# EAGLE design Mixer-Analog-OPA4134-Rev-K-multi (EAGLE 8.6.0)
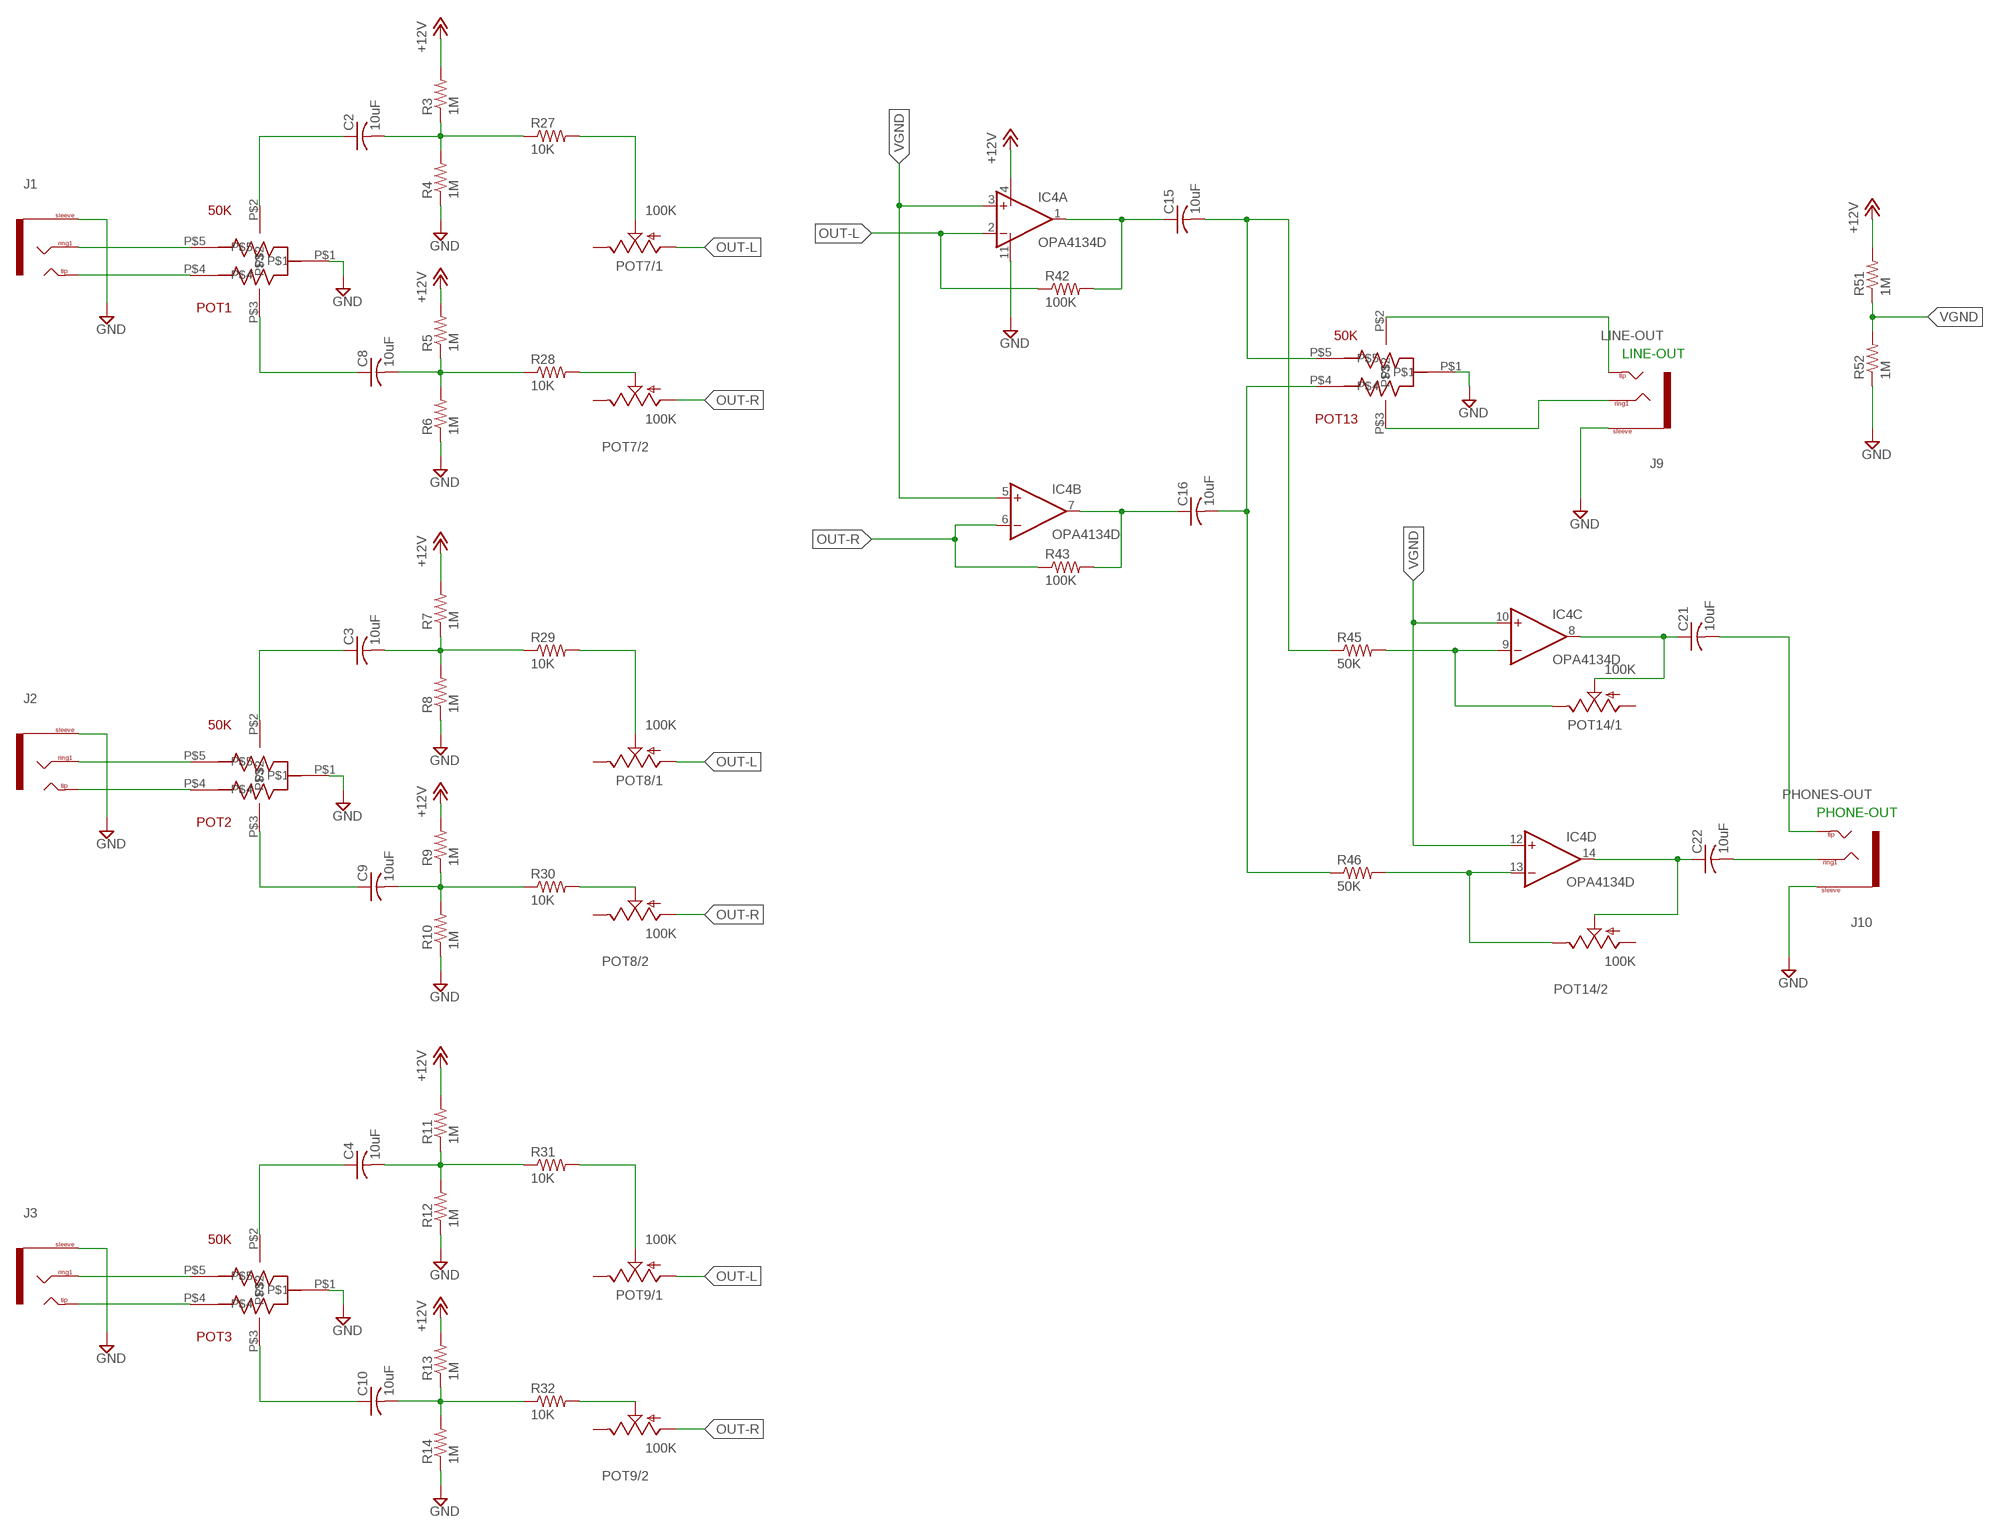
[diagram p0: schematic, sheet 1, part 1 of 2]
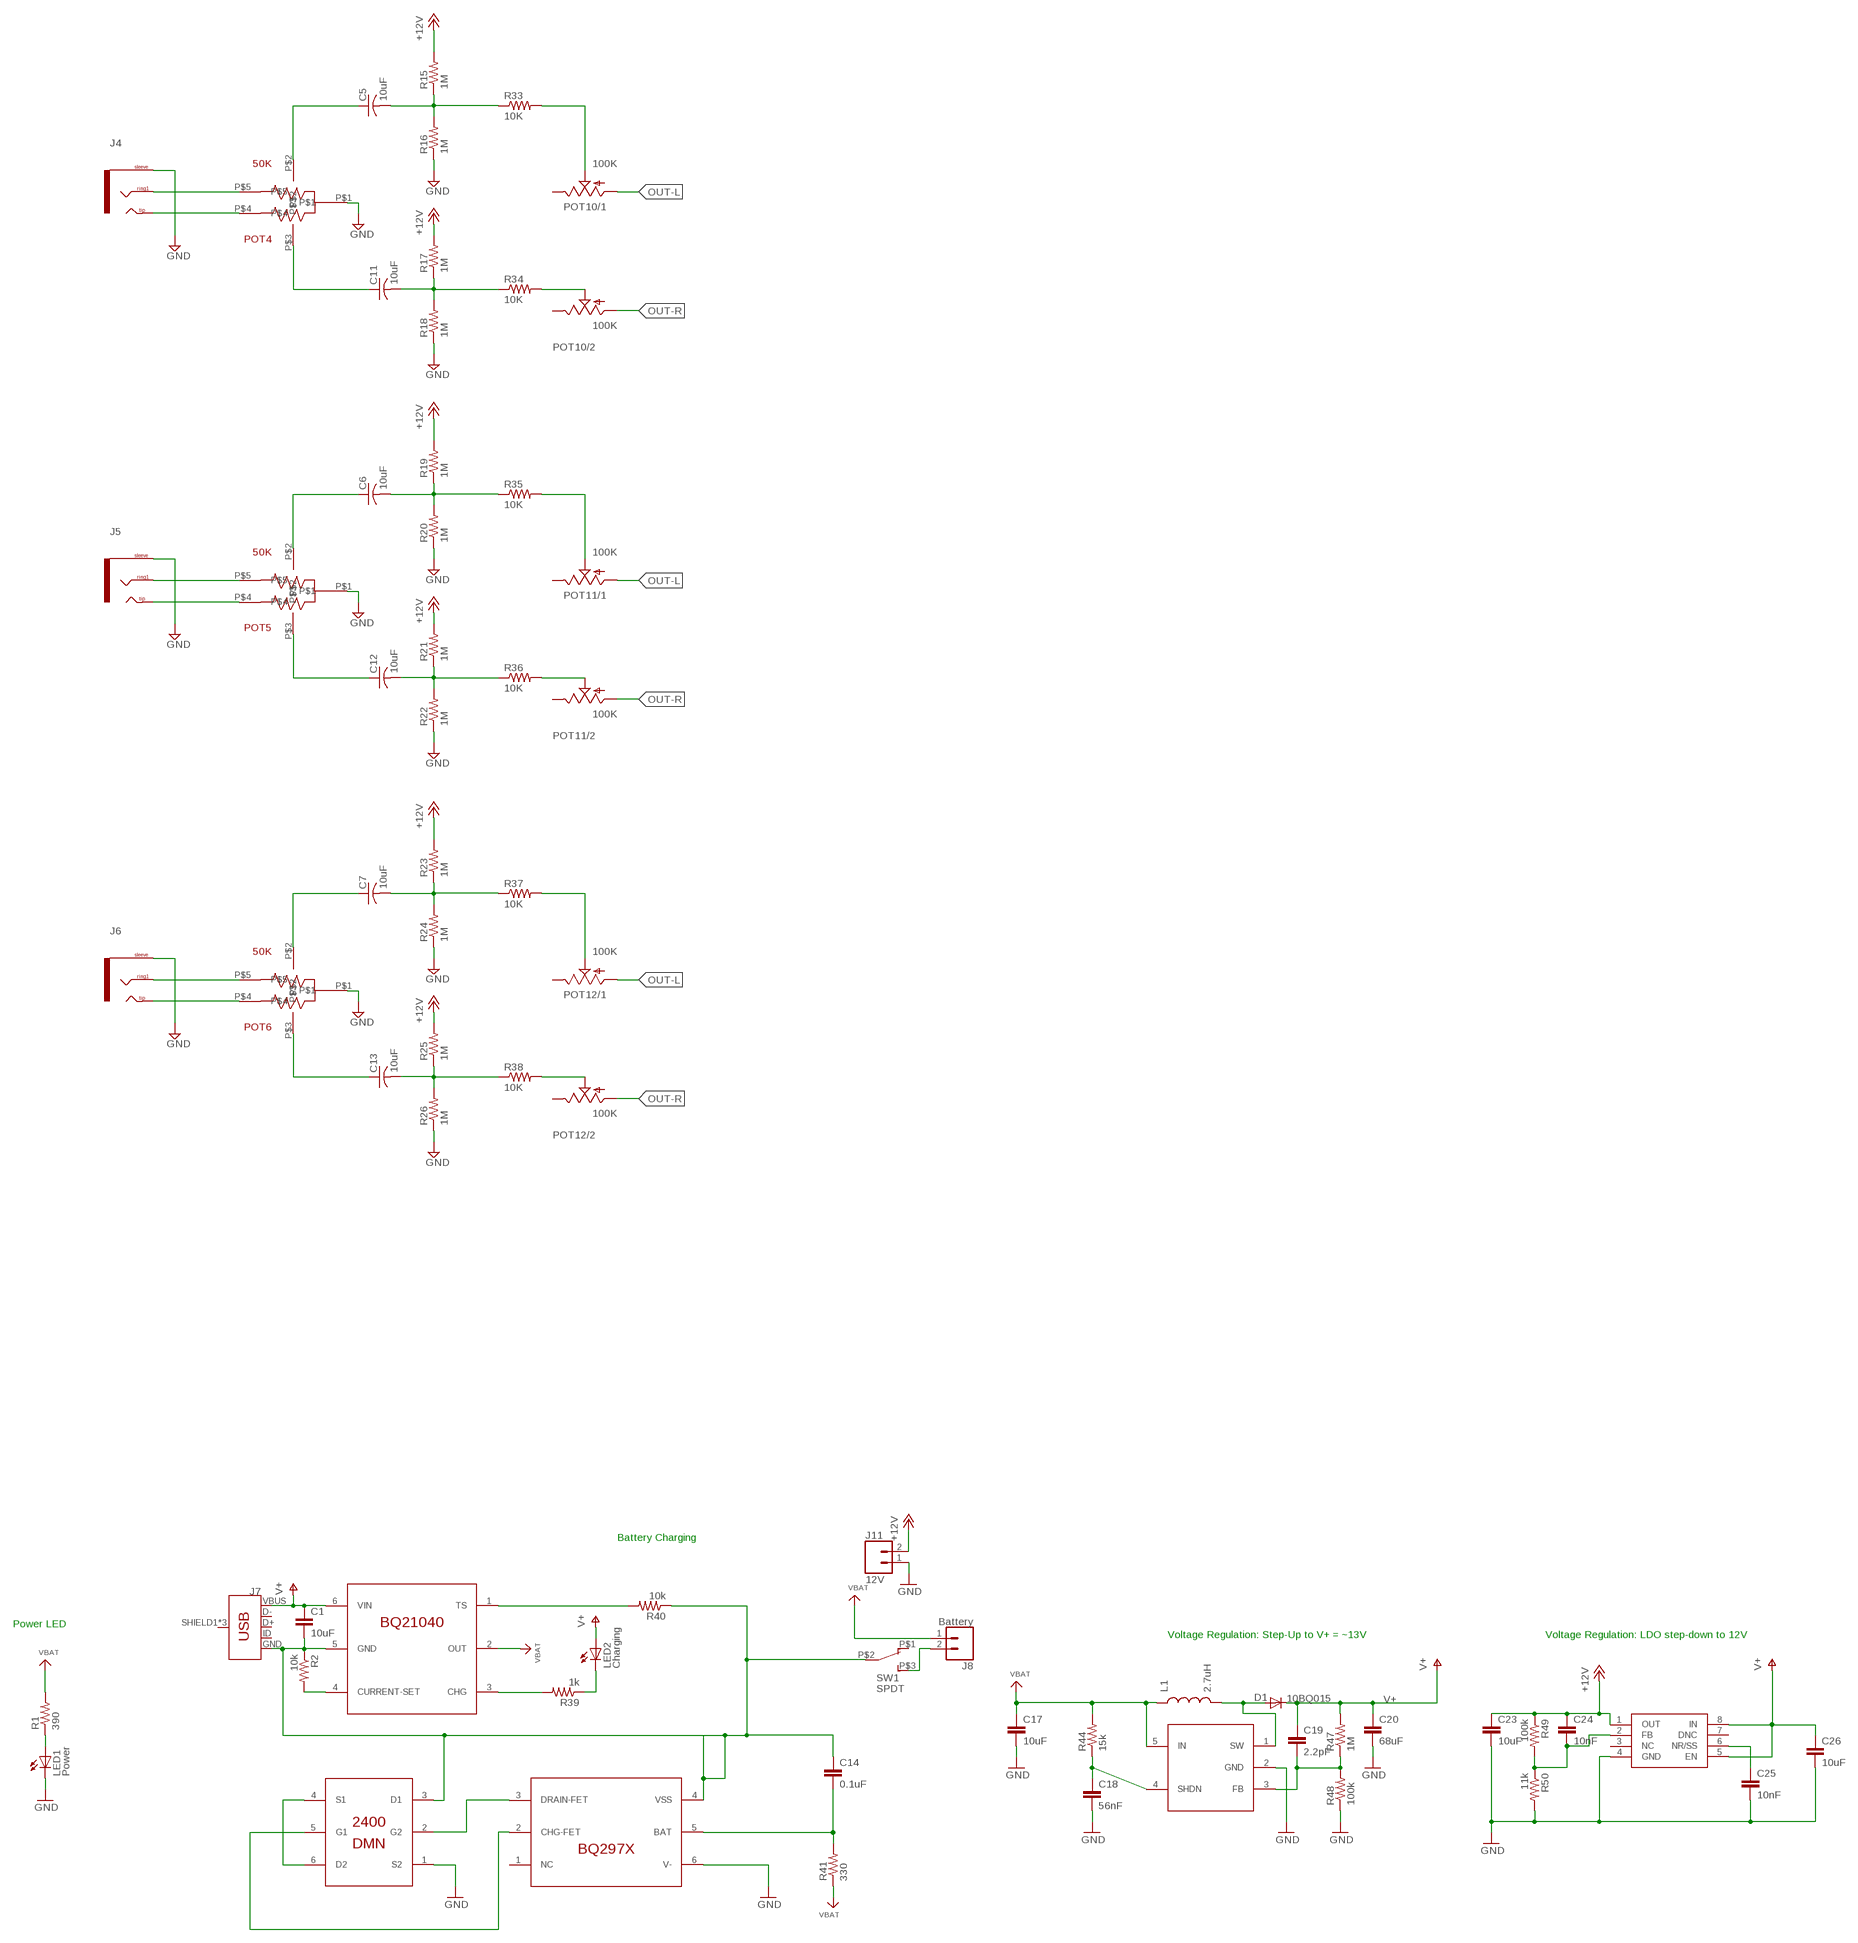
[diagram p1: schematic, sheet 1, part 2 of 2]

## Parts
C1  10uF  C-EUC0603  [C0603]
C2  10uF  C-USC0805K  [C0805K]
C3  10uF  C-USC0805K  [C0805K]
C4  10uF  C-USC0805K  [C0805K]
C5  10uF  C-USC0805K  [C0805K]
C6  10uF  C-USC0805K  [C0805K]
C7  10uF  C-USC0805K  [C0805K]
C8  10uF  C-USC0805K  [C0805K]
C9  10uF  C-USC0805K  [C0805K]
C10  10uF  C-USC0805K  [C0805K]
C11  10uF  C-USC0805K  [C0805K]
C12  10uF  C-USC0805K  [C0805K]
C13  10uF  C-USC0805K  [C0805K]
C14  0.1uF  C-EUC0603  [C0603]
C15  10uF  C-USC0805K  [C0805K]
C16  10uF  C-USC0805K  [C0805K]
C17  10uF  C-EUC0603  [C0603]
C18  56nF  C-EUC0603  [C0603]
C19  2.2pF  C-EUC0603  [C0603]
C20  68uF  C-EUC1206  [C1206]
C21  10uF  C-USC0805K  [C0805K]
C22  10uF  C-USC0805K  [C0805K]
C23  10uF  C-EUC0603  [C0603]
C24  10nF  C-EUC0603  [C0603]
C25  10nF  C-EUC0603  [C0603]
C26  10uF  C-EUC0603  [C0603]
D1  10BQ015  DIODESMA  [SMA-DIODE]
IC1  DMN2400  DUAL-NFET-DMN2400  [SOT-563]
IC2  BQ21040  BQ21040-LIPO-CHARGER  [SOT23-6]
IC3  BQ297X  BQ297X-BATTERY-MANAGER  [WSON-6]
IC4  OPA4134D  [SO14]
IC5  SC4503  [SOT23-5]
IC6  TPS7A49  [MSOP-8]
J1  TRS-1/8"-3.5MM  [TRS_SJ-3524-SMT]
J2  TRS-1/8"-3.5MM  [TRS_SJ-3524-SMT]
J3  TRS-1/8"-3.5MM  [TRS_SJ-3524-SMT]
J4  TRS-1/8"-3.5MM  [TRS_SJ-3524-SMT]
J5  TRS-1/8"-3.5MM  [TRS_SJ-3524-SMT]
J6  TRS-1/8"-3.5MM  [TRS_SJ-3524-SMT]
J7  USB_MICRO-BREDUCED_PASTE  [USB-B-MICRO-SMD_RED_PASTE]
J8  Battery  CONN_02LOCK  [1X02_LOCK]
J9  LINE-OUT  TRS-1/8"-3.5MM  [TRS_SJ-3524-SMT]
J10  PHONES-OUT  TRS-1/8"-3.5MM  [TRS_SJ-3524-SMT]
J11  12V  CONN_02LOCK  [1X02_LOCK]
L1  2.7uH  INDUCTORCR54-KIT  [CR54-KIT]
LED1  Power  LED3MM  [LED3MM]
LED2  Charging  LED3MM  [LED3MM]
POT1  50K  POT-DUAL-ALPS-RK10J12E0A0A  [POT-DUAL-ALPS-RK10J12E0A0A]
POT2  50K  POT-DUAL-ALPS-RK10J12E0A0A  [POT-DUAL-ALPS-RK10J12E0A0A]
POT3  50K  POT-DUAL-ALPS-RK10J12E0A0A  [POT-DUAL-ALPS-RK10J12E0A0A]
POT4  50K  POT-DUAL-ALPS-RK10J12E0A0A  [POT-DUAL-ALPS-RK10J12E0A0A]
POT5  50K  POT-DUAL-ALPS-RK10J12E0A0A  [POT-DUAL-ALPS-RK10J12E0A0A]
POT6  50K  POT-DUAL-ALPS-RK10J12E0A0A  [POT-DUAL-ALPS-RK10J12E0A0A]
POT7  100K  POT-DUAL-PTV112-4420  [PTV112]
POT8  100K  POT-DUAL-PTV112-4420  [PTV112]
POT9  100K  POT-DUAL-PTV112-4420  [PTV112]
POT10  100K  POT-DUAL-PTV112-4420  [PTV112]
POT11  100K  POT-DUAL-PTV112-4420  [PTV112]
POT12  100K  POT-DUAL-PTV112-4420  [PTV112]
POT13  50K  POT-DUAL-ALPS-RK10J12E0A0A  [POT-DUAL-ALPS-RK10J12E0A0A]
POT14  100K  POT-DUAL-PTV112-4420  [PTV112]
R1  390  R-US_R0603  [R0603]
R2  10k  R-US_R0603  [R0603]
R3  1M  RESISTOR0603-RES  [0603-RES]
R4  1M  RESISTOR0603-RES  [0603-RES]
R5  1M  RESISTOR0603-RES  [0603-RES]
R6  1M  RESISTOR0603-RES  [0603-RES]
R7  1M  RESISTOR0603-RES  [0603-RES]
R8  1M  RESISTOR0603-RES  [0603-RES]
R9  1M  RESISTOR0603-RES  [0603-RES]
R10  1M  RESISTOR0603-RES  [0603-RES]
R11  1M  RESISTOR0603-RES  [0603-RES]
R12  1M  RESISTOR0603-RES  [0603-RES]
R13  1M  RESISTOR0603-RES  [0603-RES]
R14  1M  RESISTOR0603-RES  [0603-RES]
R15  1M  RESISTOR0603-RES  [0603-RES]
R16  1M  RESISTOR0603-RES  [0603-RES]
R17  1M  RESISTOR0603-RES  [0603-RES]
R18  1M  RESISTOR0603-RES  [0603-RES]
R19  1M  RESISTOR0603-RES  [0603-RES]
R20  1M  RESISTOR0603-RES  [0603-RES]
R21  1M  RESISTOR0603-RES  [0603-RES]
R22  1M  RESISTOR0603-RES  [0603-RES]
R23  1M  RESISTOR0603-RES  [0603-RES]
R24  1M  RESISTOR0603-RES  [0603-RES]
R25  1M  RESISTOR0603-RES  [0603-RES]
R26  1M  RESISTOR0603-RES  [0603-RES]
R27  10K  RESISTOR0603-RES  [0603-RES]
R28  10K  RESISTOR0603-RES  [0603-RES]
R29  10K  RESISTOR0603-RES  [0603-RES]
R30  10K  RESISTOR0603-RES  [0603-RES]
R31  10K  RESISTOR0603-RES  [0603-RES]
R32  10K  RESISTOR0603-RES  [0603-RES]
R33  10K  RESISTOR0603-RES  [0603-RES]
R34  10K  RESISTOR0603-RES  [0603-RES]
R35  10K  RESISTOR0603-RES  [0603-RES]
R36  10K  RESISTOR0603-RES  [0603-RES]
R37  10K  RESISTOR0603-RES  [0603-RES]
R38  10K  RESISTOR0603-RES  [0603-RES]
R39  1k  R-US_R0603  [R0603]
R40  10k  R-US_R0603  [R0603]
R41  330  R-US_R0603  [R0603]
R42  100K  RESISTOR0603-RES  [0603-RES]
R43  100K  RESISTOR0603-RES  [0603-RES]
R44  15k  R-US_R0603  [R0603]
R45  50K  RESISTOR0603-RES  [0603-RES]
R46  50K  RESISTOR0603-RES  [0603-RES]
R47  1M  R-US_R0603  [R0603]
R48  100k  R-US_R0603  [R0603]
R49  100k  R-US_R0603  [R0603]
R50  11k  R-US_R0603  [R0603]
R51  1M  RESISTOR0603-RES  [0603-RES]
R52  1M  RESISTOR0603-RES  [0603-RES]
SW1  SPDT  SWITCH_SPDTCL-SB-12B  [SWITCH_SPDT_CL-SB-12B]

## Nets
+12V: C23.1 C24.1 IC4.4(P:V+) IC6.1(OUT) J11.2 R3.2 R5.2 R7.2 R9.2 R11.2 R13.2 R15.2 R17.2 R19.2 R21.2 R23.2 R25.2 R49.1 R51.2
GND: C17.2 C18.2 C20.2 C23.2 C25.2 C26.2 IC1.1(S2) IC3.6(V-) IC4.11(P:V-) IC6.4(GND) J1.1(SLEEVE) J2.1(SLEEVE) J3.1(SLEEVE) J4.1(SLEEVE) J5.1(SLEEVE) J6.1(SLEEVE) J9.1(SLEEVE) J10.1(SLEEVE) J11.1 LED1.K(C) POT1.P$1 POT2.P$1 POT3.P$1 POT4.P$1 POT5.P$1 POT6.P$1 POT13.P$1 R4.1 R6.1 R8.1 R10.1 R12.1 R14.1 R16.1 R18.1 R20.1 R22.1 R24.1 R26.1 R48.1 R50.2 R52.1
GND1: C1.2 C14.1 IC1.3(D1) IC2.5(GND) IC3.4(VSS) J7.GND R2.1 R40.1 SW1.P$2
N$1: C8.1 POT1.P$3
N$2: J8.2 SW1.P$3
N$3: C8.2 R5.1 R6.2 R28.1
N$5: J1.3(RING1) POT1.P$5
N$7: C15.1 IC4.1(A:OUT) R42.2
N$8: C2.1 POT1.P$2
N$9: J1.2(TIP) J1.4(TIP) POT1.P$4
N$13: C2.2 R3.1 R4.2 R27.1
N$15: IC4.13(D:-IN) POT14.2.3(/2:E) R46.2
N$16: J9.2(TIP) J9.4(TIP) POT13.P$2
N$17: C16.1 IC4.7(B:OUT) R43.2
N$18: J9.3(RING1) POT13.P$3
N$19: POT7.2.2(/2:S) R28.2
N$21: C22.2 J10.3(RING1)
N$22: C9.2 R9.1 R10.2 R30.1
N$23: C21.2 J10.2(TIP) J10.4(TIP)
N$24: C21.1 IC4.8(C:OUT) POT14.1.2(/1:S)
N$25: C22.1 IC4.14(D:OUT) POT14.2.2(/2:S)
N$26: J2.3(RING1) POT2.P$5
N$27: POT8.1.2(/1:S) R29.2
N$28: C9.1 POT2.P$3
N$29: C3.1 POT2.P$2
N$30: J2.2(TIP) J2.4(TIP) POT2.P$4
N$31: C3.2 R7.1 R8.2 R29.1
N$32: POT8.2.2(/2:S) R30.2
N$41: C10.2 R13.1 R14.2 R32.1
N$42: J3.3(RING1) POT3.P$5
N$43: POT9.1.2(/1:S) R31.2
N$44: C10.1 POT3.P$3
N$45: C4.1 POT3.P$2
N$46: J3.2(TIP) J3.4(TIP) POT3.P$4
N$47: C4.2 R11.1 R12.2 R31.1
N$48: POT9.2.2(/2:S) R32.2
N$55: POT7.1.2(/1:S) R27.2
N$58: C11.2 R17.1 R18.2 R34.1
N$59: J4.3(RING1) POT4.P$5
N$60: POT10.1.2(/1:S) R33.2
N$61: C15.2 POT13.P$5 R45.1
N$62: C11.1 POT4.P$3
N$63: C5.1 POT4.P$2
N$64: J4.2(TIP) J4.4(TIP) POT4.P$4
N$65: C5.2 R15.1 R16.2 R33.1
N$66: POT10.2.2(/2:S) R34.2
N$75: C12.2 R21.1 R22.2 R36.1
N$76: J5.3(RING1) POT5.P$5
N$77: POT11.1.2(/1:S) R35.2
N$78: C12.1 POT5.P$3
N$79: C6.1 POT5.P$2
N$80: J5.2(TIP) J5.4(TIP) POT5.P$4
N$81: C6.2 R19.1 R20.2 R35.1
N$82: POT11.2.2(/2:S) R36.2
N$91: C13.2 R25.1 R26.2 R38.1
N$92: J6.3(RING1) POT6.P$5
N$93: POT12.1.2(/1:S) R37.2
N$94: C13.1 POT6.P$3
N$95: C7.1 POT6.P$2
N$96: J6.2(TIP) J6.4(TIP) POT6.P$4
N$97: C7.2 R23.1 R24.2 R37.1
N$98: POT12.2.2(/2:S) R38.2
N$114: LED1.A R1.1
N$115: D1.A IC5.1(SW) L1.P$2
N$116: C18.1 IC5.4(SHDN) R44.1
N$117: C19.2 IC5.3(FB) R47.1 R48.2
N$118: C24.2 IC6.2(FB) R49.2 R50.1
N$119: C25.1 IC6.6(NR/SS)
N$121: LED2.K(C) R39.1
N$122: IC2.3(CHG) R39.2
N$123: IC2.1(TS) R40.2
N$124: IC2.4(CURRENT-SET) R2.2
N$125: C14.2 IC3.5(BAT) R41.2
N$126: IC1.4(S1) IC1.6(D2)
N$127: IC1.5(G1) IC3.2(CHG-FET)
N$128: IC1.2(G2) IC3.3(DRAIN-FET)
OUT-L: IC4.2(A:-IN) POT7.1.1(/1:A) POT8.1.1(/1:A) POT9.1.1(/1:A) POT10.1.1(/1:A) POT11.1.1(/1:A) POT12.1.1(/1:A) R42.1
OUT-L1: IC4.9(C:-IN) POT14.1.3(/1:E) R45.2
OUT-R: IC4.6(B:-IN) POT7.2.1(/2:A) POT8.2.1(/2:A) POT9.2.1(/2:A) POT10.2.1(/2:A) POT11.2.1(/2:A) POT12.2.1(/2:A) R43.1
OUT-R1: C16.2 POT13.P$4 R46.1
V+: C1.1 C19.1 C20.1 C26.1 D1.C IC2.6(VIN) IC6.5(EN) IC6.8(IN) J7.VBUS LED2.A R47.2
VBAT: C17.1 IC2.2(OUT) IC5.5(IN) J8.1 L1.P$1 R1.2 R41.1 R44.2
VGND: IC4.3(A:+IN) IC4.5(B:+IN) IC4.10(C:+IN) IC4.12(D:+IN) R51.1 R52.2
Unconnected: IC3.1(NC) IC5.2(GND) IC6.3(NC) IC6.7(DNC) J7.D+ J7.D- J7.ID J7.SHIELD1(SHIELD) J7.SHIELD2(SHIELD) J7.SHIELD3(SHIELD) POT7.1.3(/1:E) POT7.2.3(/2:E) POT8.1.3(/1:E) POT8.2.3(/2:E) POT9.1.3(/1:E) POT9.2.3(/2:E) POT10.1.3(/1:E) POT10.2.3(/2:E) POT11.1.3(/1:E) POT11.2.3(/2:E) POT12.1.3(/1:E) POT12.2.3(/2:E) POT14.1.1(/1:A) POT14.2.1(/2:A) SW1.P$1

## Notes on the sheet
- LINE-OUT
- PHONE-OUT
- Battery Charging
- Power LED
- Voltage Regulation: Step-Up to V+ = ~13V | Voltage Regulation: LDO step-down to 12V

## Library data of the parts
C1 C14 C17-C20 C23-C26 = rcl:C-EU: CAPACITOR, European symbol; SPICEPREFIX: C
C2-C13 C15 C16 C21 C22 = adafruit:C-US: CAPACITOR, American symbol
D1 = SparkFun:DIODE: Diode These are standard reverse protection diodes and small signal diodes. SMA package can handle up to about 1A. SOD-323 can handle about 200mA. What the SOD-323 package when ordering, there are some mfgs out there that are 5-pin packages.
IC1 = CMU-ArtFab:DUAL-NFET-DMN2400
IC2 = CMU-ArtFab:BQ21040-LIPO-CHARGER
IC3 = CMU-ArtFab:BQ297X-BATTERY-MANAGER
IC4 = linear:OPA4134: SoundPLUS (TM) High Performance AUDIO OPERATIONAL AMPLIFIERS Source: http://focus.ti.com/lit/ds/sbos058/sbos058.pdf
IC5 = CMU-ArtFab:SC4503
IC6 = CMU-ArtFab:TPS7A49
J1-J6 J9 J10 = CMU-ArtFab:TRS-1/8"-3.5MM
J7 = SparkFun-Connectors:USB_MICRO-B: USB Type Micro-B Connector Male/female and PTH/SMT variants SparkFun Products: SparkFun microB USB Breakout <https://www.sparkfun.com/products/12035> SparkFun USB microB Plug Breakout <https://www.sparkfun.com/products/10031> SparkFun ESP8266 Thing <https://www.sparkfun.com/products/13231>; PROD_ID: CONN-11752
J8 J11 = SparkFun-Connectors:CONN_02: Multi connection point. Often used as Generic Header-pin footprint for 0.1 inch spaced/style header connections On any of the 0.1 inch spaced packages, you can populate with these: Break Away Headers - Straight <https://www.sparkfun.com/products/116> (PRT-00116) Break Away Male Headers - Right Angle <https://www.sparkfun.com/products/553> (PRT-00553) Female Headers <https://www.sparkfun.com/products/115> (PRT-00115) Break Away Headers - Machine Pin <https://www.sparkfun.com/products/117> (PRT-00117) Break Away Female Headers - Swiss Machine Pin <https://www.sparkfun.com/products/743> (PRT-00743) For SCREWTERMINALS and SPRING TERMINALS visit here: Screw Terimnals on SparkFun.com <https://www.sparkfun.com/search/results?term=Screw+Terminals> (5mm/3.5mm/2.54mm spacing) This device is also useful as a general connection point to wire up your design to another part of your project. Our various solder wires solder well into these plated through hole pads. Hook-Up Wire - Assortment (Stranded, 22 AWG) <https://www.sparkfun.com/products/11375> (PRT-11375) Hook-Up Wire - Assortment (Solid Core, 22 AWG) <https://www.sparkfun.com/products/11367> (PRT-11367) View the entire wire category on our website here <https://www.sparkfun.com/categories/141> Special notes: Molex polarized connector foot print use with: PRT-08233 with associated crimp pins and housings. 2.54_SCREWTERM for use with PRT-10571. 3.5mm Screw Terminal footprints for PRT-08084 5mm Screw Terminal footprints for use with PRT-08432
L1 = SparkFun-Passives:INDUCTOR: Inductors Basic Inductor/Choke - 0603 and 1206. Footprints are not proven and vary greatly between part numbers. SRN6045- 33uH, 20% 1.4A SDR0403-560KL - 56uH, 10%, 500mA RMS/740mA peak
LED1 LED2 = led:LED: LED OSRAM: - CHIPLED LG R971, LG N971, LY N971, LG Q971, LY Q971, LO R971, LY R971 LH N974, LH R974 LS Q976, LO Q976, LY Q976 LO Q996 - Hyper CHIPLED LW Q18S LB Q993, LB Q99A, LB R99A - SideLED LS A670, LO A670, LY A670, LG A670, LP A670 LB A673, LV A673, LT A673, LW A673 LH A674 LY A675 LS A676, LA A676, LO A676, LY A676, LW A676 LS A679, LY A679, LG A679 - Hyper Micro SIDELED® LS Y876, LA Y876, LO Y876, LY Y876 LT Y87S - SmartLED LW L88C, LW L88S LB L89C, LB L89S, LG L890 LS L89K, LO L89K, LY L89K LS L896, LA L896, LO L896, LY L896 - TOPLED LS T670, LO T670, LY T670, LG T670, LP T670 LSG T670, LSP T670, LSY T670, LOP T670, LYG T670 LG T671, LOG T671, LSG T671 LB T673, LV T673, LT T673, LW T673 LH T674 LS T676, LA T676, LO T676, LY T676, LB T676, LH T676, LSB T676, LW T676 LB T67C, LV T67C, LT T67C, LS T67K, LO T67K, LY T67K, LW E67C LS E67B, LA E67B, LO E67B, LY E67B, LB E67C, LV E67C, LT E67C LW T67C LS T679, LY T679, LG T679 LS T770, LO T770, LY T770, LG T770, LP T770 LB T773, LV T773, LT T773, LW T773 LH T774 LS E675, LA E675, LY E675, LS T675 LS T776, LA T776, LO T776, LY T776, LB T776 LHGB T686 LT T68C, LB T68C - Hyper Mini TOPLED® LB M676 - Mini TOPLED Santana® LG M470 LS M47K, LO M47K, LY M47K Source: http://www.osram.convergy.de LUXEON: - LUMILED® LXK2-PW12-R00, LXK2-PW12-S00, LXK2-PW14-U00, LXK2-PW14-V00 LXK2-PM12-R00, LXK2-PM12-S00, LXK2-PM14-U00 LXK2-PE12-Q00, LXK2-PE12-R00, LXK2-PE12-S00, LXK2-PE14-T00, LXK2-PE14-U00 LXK2-PB12-K00, LXK2-PB12-L00, LXK2-PB12-M00, LXK2-PB14-N00, LXK2-PB14-P00, LXK2-PB14-Q00 LXK2-PR12-L00, LXK2-PR12-M00, LXK2-PR14-Q00, LXK2-PR14-R00 LXK2-PD12-Q00, LXK2-PD12-R00, LXK2-PD12-S00 LXK2-PH12-R00, LXK2-PH12-S00 LXK2-PL12-P00, LXK2-PL12-Q00, LXK2-PL12-R00 Source: www.luxeon.com KINGBRIGHT: KA-3528ASYC Source: www.kingbright.com
POT1-POT6 POT13 = CMU-ArtFab:POT-DUAL-ALPS-RK10J12E0A0A
POT7-POT12 POT14 = CMU-ArtFab:POT-DUAL-PTV112: Bourns 11mm dual potentiometer; AVAILABILITY: Unavailable; DESCRIPTION: Alt# Tce-10111410; MF: STMicroelectronics; MP: PTV112; PACKAGE: None; PRICE: None; SPICEPREFIX: J
R1 R2 R39-R41 R44 R47-R50 = CMU-ArtFab:R-US_: RESISTOR, American symbol
R3-R38 R42 R43 R45 R46 = SparkFun-Passives:RESISTOR: Resistor Basic schematic elements and footprints for 0603, 1206, and PTH resistors.; SPICEPREFIX: R
R51 R52 = SparkFun-Passives:RESISTOR: Resistor Basic schematic elements and footprints for 0603, 1206, and PTH resistors.
SW1 = CMU-ArtFab:SWITCH_SPDT

## Board
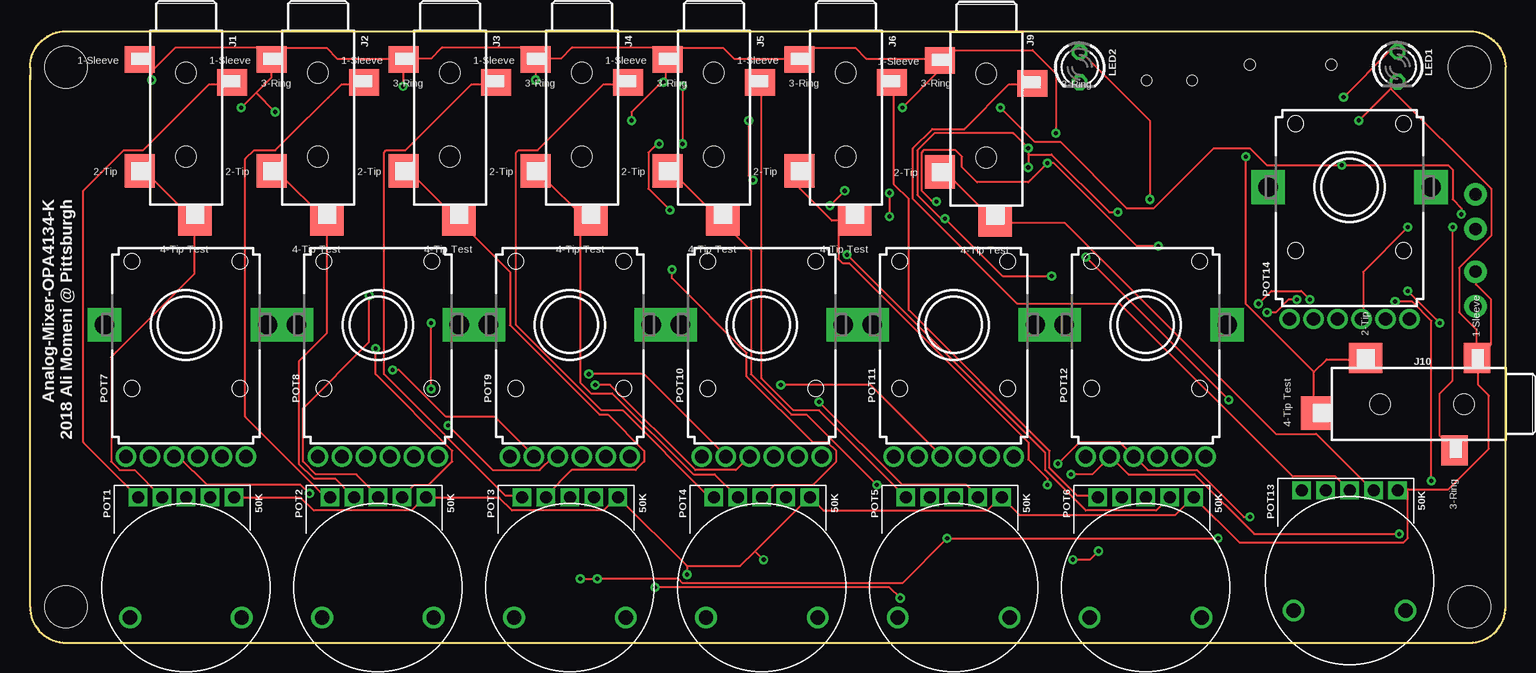
[diagram p2: board, top side]
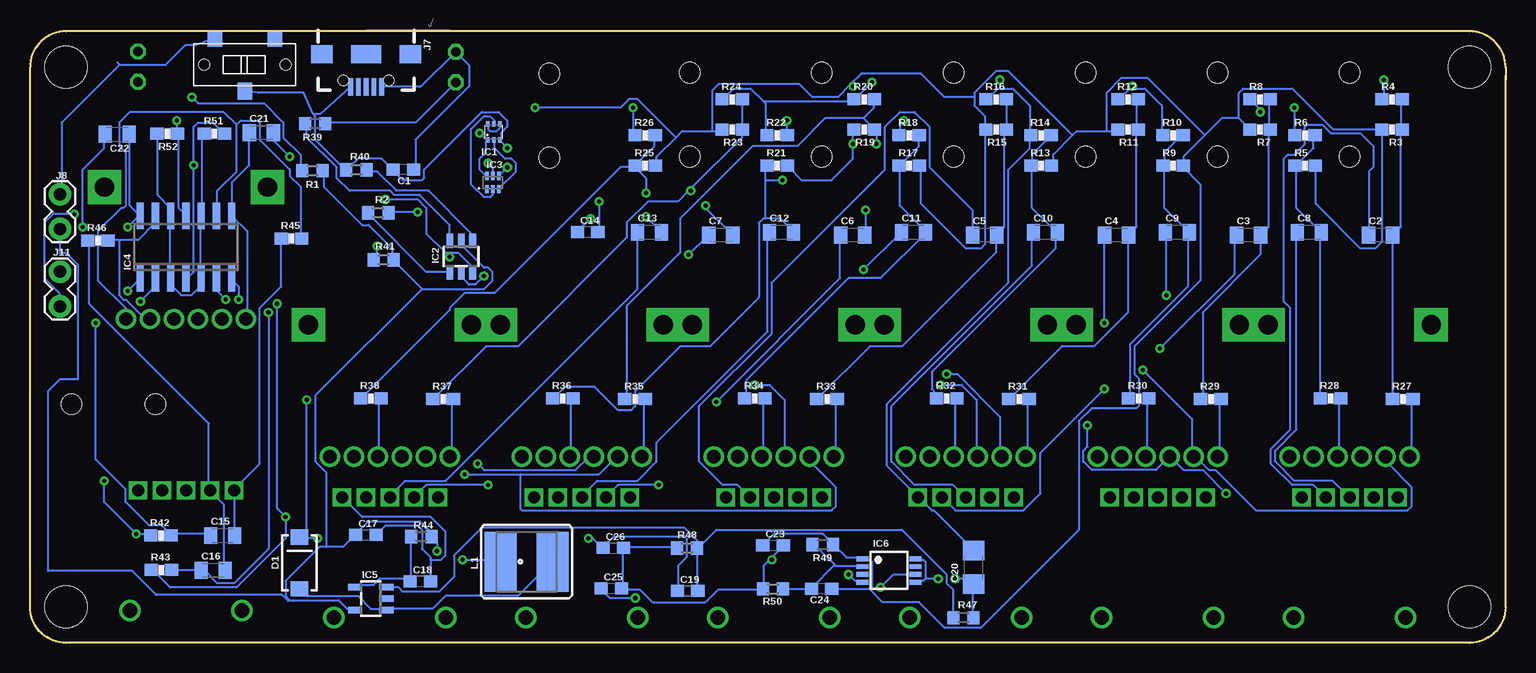
[diagram p3: board, bottom side, seen from below]

Size 123 x 51 mm. Coordinates in mm from the lower left corner, seen from the top.
Outline: 0,47 0,47.3
Outline: 0,47 0,48 arc-90 3,51 120,51 arc-90 123,48 123,3 arc-90 120,0 3,0 arc-90 0,3 0,47
Copper layers (1*16): Top 0.035mm / dielectric 1.5mm / Bottom 0.035mm
Design rules "default *": minimum track width 6mil, minimum drill 0.35mm, track to track 8mil, track to pad 8mil, pad to pad 8mil, via to via 8mil, smd to smd 8mil, copper to edge 40mil, drill to drill 6mil, minimum pad ring 10mil, minimum via ring 8mil, stop-mask expansion 4mil, vias tented up to drill 0mil, thermal gap 10mil
Holes 3.5 mm at 3,48 3,3 120,3 120,48

### Footprints (pad centres in the part's own frame; a part is rotated, then mirrored left to right if it is on the bottom)
C0603 = smd 1.1 x 1: 1 -0.85,0; 2 0.85,0
C0805K = smd 1.1 x 1.4: 1 -1,0; 2 1,0
C1206 = smd 1.6 x 1.8: 1 -1.4,0; 2 1.4,0
SMA-DIODE = smd 1.27 x 1.47: A -2.15,0; C 2.15,0
SOT-563 = smd 0.3 x 0.45: 1 -0.5,-0.675; 2 0,-0.675; 3 0.5,-0.675; 4 0.5,0.675; 5 0,0.675; 6 -0.5,0.675
SOT23-6 = smd 0.55 x 1.2: 1 -0.95,-1.3; 2 0,-1.3; 3 0.95,-1.3; 4 0.95,1.3; 5 0,1.3; 6 -0.95,1.3
WSON-6 = smd 0.3 x 0.7: 1 -0.5,-0.55; 2 0,-0.55; 3 0.5,-0.55; 4 0.5,0.55; 5 0,0.55; 6 -0.5,0.55
SO14 = smd 0.6 x 2.2: 1 -3.81,-2.6; 2 -2.54,-2.6; 3 -1.27,-2.6; 4 0,-2.6; 5 1.27,-2.6; 6 2.54,-2.6; 7 3.81,-2.6; 8 3.81,2.6; 9 2.54,2.6; 10 1.27,2.6; 11 0,2.6; 12 -1.27,2.6; 13 -2.54,2.6; 14 -3.81,2.6
SOT23-5 = smd 0.55 x 1.2: 1 -0.95,-1.3; 2 0,-1.3; 3 0.95,-1.3; 4 0.95,1.3; 5 -0.95,1.3
MSOP-8 = smd 0.4 x 1: 1 -0.975,-2.2; 2 -0.325,-2.2; 3 0.325,-2.2; 4 0.975,-2.2; 5 0.975,2.2; 6 0.325,2.2; 7 -0.325,2.2; 8 -0.975,2.2
TRS_SJ-3524-SMT = smd 2.5 x 2.2: 1 3.85,-4.6; 3 -3.85,-2.7 | smd 2.5 x 2.8: 2 3.85,4.7 | smd 2.8 x 2.5: 4 -0.75,8.85 | hole 1.7: 0,-3.5; 0,3.5
USB-B-MICRO-SMD_RED_PASTE = smd 1.45 x 0.4: D+ 2.725,0; D- 2.725,0.65; GND 2.725,-1.3; ID 2.725,-0.65; VBUS 2.725,1.3 | smd 1.5 x 1.8: SHIELD1 0,3.685; SHIELD2 0,-3.685 | smd 1.5 x 2.5: SHIELD3 0,0 | hole 0.85: 2.2,1.9; 2.2,-1.9
1X02_LOCK = drill 1.016 pad 1.88: 1 -0.178,0; 2 2.718,0
CR54-KIT = smd 5 x 2.65: P$1 0,2.17; P$2 0,-2.17
LED3MM = drill 0.813 octagon: A -1.27,0; K 1.27,0
POT-DUAL-ALPS-RK10J12E0A0A = drill 1 pad 1.321 square: P$1 -4,0; P$2 -2,0; P$3 0,0; P$4 2,0; P$5 4,0 | drill 1.2: P$6 4.65,10; P$7 -4.65,10
PTV112 = drill 1.1 pad 1.676: 1.1 -3,-11; 1.2 -5,-11; 1.3 5,-11; 2.1 -1,-11; 2.2 1,-11; 2.3 3,-11 | drill 1.6 pad 2.8 square: M1 -6.8,0; M2 6.8,0
R0603 = smd 1 x 1.1: 1 -0.85,0; 2 0.85,0
0603-RES = smd 1.1 x 1: 1 -0.85,0; 2 0.85,0
SWITCH_SPDT_CL-SB-12B = smd 1.2 x 1.4: P$1 -2.5,-2.2; P$2 0,2.2; P$3 2.5,-2.2 | hole 0.9: -3.4,0; 3.4,0

### Placement (x,y rotation side)
C1  91.88,39.46 180 bottom
C2  10.42,34 0 bottom
C3  21.42,34 0 bottom
C4  32.42,34 0 bottom
C5  43.42,34 0 bottom
C6  54.42,34 0 bottom
C7  65.42,34 0 bottom
C8  16.35,34.23 0 bottom
C9  27.35,34.23 0 bottom
C10  38.35,34.23 0 bottom
C11  49.35,34.23 0 bottom
C12  60.35,34.23 0 bottom
C13  71.35,34.23 0 bottom
C14  76.51,34.27 0 bottom
C15  106.94,8.94 0 bottom
C16  107.73,6.04 0 bottom
C17  95,9 0 bottom
C18  90.46,5.14 0 bottom
C19  68.18,4.33 0 bottom
C20  44.33,6.29 90 bottom
C21  103.71,42.54 0 bottom
C22  115.73,42.41 180 bottom
C23  61.06,8.13 0 bottom
C24  57.01,4.52 180 bottom
C25  74.55,4.54 0 bottom
C26  74.38,7.9 0 bottom
D1  100.53,6.66 90 bottom
IC1  84.34,42.61 0 bottom
IC2  87.06,32.21 180 bottom
IC3  84.43,38.39 0 bottom
IC4  110,33 0 bottom
IC5  94.59,3.69 90 bottom
IC6  51.39,6.03 270 bottom
J1  13,44.04 180 top
J2  24,44.04 180 top
J3  35,44.04 180 top
J4  46,44.04 180 top
J5  57,44.04 180 top
J6  68,44.04 180 top
J7  94.98,49.09 270 bottom
J8  120.5,34.68 90 bottom
J9  79.72,43.96 180 top
J10  116.04,19.9 90 top
J11  120.5,30.77 270 bottom
L1  81.6,6.77 90 bottom
LED1  114,48.05 270 top
LED2  87.5,48.01 270 top
POT1  13,12.12 180 top
POT2  29,12.12 180 top
POT3  45,12.12 180 top
POT4  61,12.12 180 top
POT5  77,12.12 180 top
POT6  93,12.12 180 top
POT7  13,26.52 0 top
POT8  29,26.52 0 top
POT9  45,26.52 0 top
POT10  61,26.52 0 top
POT11  77,26.52 0 top
POT12  93,26.52 0 top
POT13  110,12.7 180 top
POT14  110,38 0 top
R1  99.46,39.37 0 bottom
R2  93.97,35.85 180 bottom
R3  9.46,42.8 180 bottom
R4  9.46,45.32 0 bottom
R5  16.7,39.79 0 bottom
R6  16.72,42.32 0 bottom
R7  20.46,42.8 180 bottom
R8  20.46,45.32 0 bottom
R9  27.7,39.79 0 bottom
R10  27.72,42.32 0 bottom
R11  31.46,42.8 180 bottom
R12  31.46,45.32 0 bottom
R13  38.7,39.79 0 bottom
R14  38.72,42.32 0 bottom
R15  42.46,42.8 180 bottom
R16  42.46,45.32 0 bottom
R17  49.7,39.79 0 bottom
R18  49.72,42.32 0 bottom
R19  53.46,42.8 180 bottom
R20  53.46,45.32 0 bottom
R21  60.7,39.79 0 bottom
R22  60.72,42.32 0 bottom
R23  64.46,42.8 180 bottom
R24  64.46,45.32 0 bottom
R25  71.7,39.79 0 bottom
R26  71.72,42.32 0 bottom
R27  8.56,20.33 0 bottom
R28  14.59,20.38 0 bottom
R29  24.56,20.33 0 bottom
R30  30.59,20.38 0 bottom
R31  40.56,20.33 0 bottom
R32  46.59,20.38 0 bottom
R33  56.56,20.33 0 bottom
R34  62.59,20.38 0 bottom
R35  72.56,20.33 0 bottom
R36  78.59,20.38 0 bottom
R37  88.56,20.33 0 bottom
R38  94.59,20.38 0 bottom
R39  99.23,43.3 180 bottom
R40  95.78,39.44 0 bottom
R41  93.52,31.93 180 bottom
R42  112.1,8.94 0 bottom
R43  112.04,6.07 0 bottom
R44  90.38,8.86 0 bottom
R45  101.2,33.72 0 bottom
R46  117.35,33.55 0 bottom
R47  45.19,2.1 0 bottom
R48  68.23,7.9 0 bottom
R49  56.91,8.18 180 bottom
R50  61.06,4.5 180 bottom
R51  107.61,42.46 0 bottom
R52  111.56,42.44 180 bottom
SW1  105.09,48.21 180 bottom

### Tracks (layer width: path | path; a pad name or v marks a point on that pad's centre or on a via)
+12V  (via drill 0.35)
  Top 0.152: v54.41,46.41 v54.41,41.6 | v80.9,44.63 83.74,41.78 85.88,41.78 91.39,36.27 93.7,36.27 98.68,41.25 101.7,41.25 103.12,39.83 v109.35,39.83 118.24,39.83 118.59,39.47 118.59,36.98 119.3,36.27 v119.3,35.74
  Bottom 0.152: 52.98,4.45 56.01,4.45 C24.1 | 52.98,4.45 52.81,4.62 52.81,6.76 52.98,6.93 53.52,6.93 IC6.1 53.7,7.11 54.94,7.11 56.01,8.18 R49.1 56.19,8.36 56.9,9.07 60.98,9.07 61.87,8.18 C23.1 | 22.23,43.74 22.23,45.87 21.87,46.23 17.78,46.23 14.4,42.85 10.31,42.85 R3.2 10.31,42.67 10.31,33.43 10.85,32.89 12.09,32.89 15.82,36.63 15.82,39.65 R5.2 | 22.23,43.74 21.34,42.85 R7.2 | 25.07,42.32 23.65,43.74 22.23,43.74 | 25.07,42.32 26.85,40.54 26.85,39.83 R9.2 26.85,39.65 25.43,38.23 25.43,30.23 30.94,24.71 30.94,22.4 30.58,22.05 30.58,19.74 30.76,19.56 34.49,19.56 35.56,18.49 35.56,9.42 43.74,1.25 46.76,1.25 48.9,3.38 51.92,3.38 52.98,4.45 | R51.2 106.86,42.49 107.75,43.38 108.99,43.38 109.35,43.03 v109.35,39.83 109.35,30.94 109.88,30.4 IC4.4 | R19.2 54.41,42.67 v54.41,41.6 54.41,40.36 56.19,38.58 58.67,38.58 59.74,39.65 R21.2 | 66.14,42.67 68.63,42.67 69.16,42.14 | 66.14,42.67 65.43,42.67 R23.2 | 69.16,42.14 70.76,40.54 70.76,39.83 R25.2 | 33.25,42.67 35.74,42.67 36.09,42.32 | 33.25,42.67 32.36,42.67 R11.2 | 36.09,42.32 37.69,40.72 37.69,39.83 R13.2 | 44.27,45.52 44.27,45.87 42.49,47.65 41.43,47.65 36.09,42.32 | 44.27,45.52 44.27,44.81 43.38,43.92 43.38,42.85 R15.2 43.38,42.67 43.38,33.25 43.74,32.89 44.98,32.89 48.72,36.63 48.72,39.65 R17.2 | 66.14,42.67 66.14,46.05 65.61,46.58 58.85,46.58 57.78,45.52 55.65,45.52 54.59,46.58 | 54.59,46.58 53.7,47.47 48.72,47.47 46.76,45.52 44.27,45.52 | 54.59,46.58 v54.41,46.41 | v80.9,44.63 73.79,44.63 73.08,45.34 72.36,45.34 69.16,42.14 | 25.07,42.32 29.87,47.12 32,47.12 33.25,45.87 33.25,42.67 | v119.3,35.74 121.08,35.74 121.79,35.03 121.79,30.4 120.55,29.16 120.55,28.09 J11.2
GND  (via drill 0.35)
  Top 0.152: 10.13,47.65 v10.13,46.94 | 10.13,47.65 9.25,48.54 J1.1 10.13,47.65 | 18.85,45.87 20.09,47.12 20.09,48.54 J2.1 | 18.85,45.87 v17.6,44.63 | 18.85,45.87 v20.45,44.27 | J3.1 31.11,48.72 25.6,48.72 24.71,49.61 21.16,49.61 20.27,48.72 J2.1 | 10.13,47.65 12.09,49.61 19.2,49.61 20.09,48.72 J2.1 | v31.11,46.41 31.11,48.54 J3.1 | v72.72,44.63 75.74,47.65 75.74,48.54 J9.1 | v85.52,42.49 85.52,47.47 83.57,49.43 76.63,49.43 75.92,48.72 J9.1 | v50.14,43.56 50.14,44.27 52.63,46.76 | 52.63,46.76 52.98,47.12 52.98,48.54 J5.1 | J4.1 42.32,48.72 44.27,48.72 45.16,49.61 52.09,49.61 52.98,48.72 J5.1 | J5.1 53.16,48.72 54.05,49.61 57.78,49.61 58.67,48.72 64.01,48.72 J6.1 64.19,48.72 65.08,49.61 68.81,49.61 69.7,48.72 75.74,48.72 J9.1 | v42.14,46.94 42.14,48.54 J4.1 | 52.63,46.76 v52.81,46.76 | J3.1 31.29,48.72 33.43,48.72 34.31,49.61 41.25,49.61 42.14,48.72 J4.1 | 114.86,12.8 114.15,12.8 POT13.P$1 | 114.86,12.8 118.24,12.8 121.61,16.18 121.61,20.62 120.73,21.51 120.73,23.65 J10.1 | 113.44,46.23 113.97,46.76 LED1.K | 113.44,46.23 v110.77,43.56 | POT1.P$1 17.07,12.09 22.58,12.09 23.65,11.02 31.83,11.02 32.89,12.09 POT2.P$1 33.07,12.09 39.12,12.09 40.18,11.02 47.83,11.02 48.9,12.09 POT3.P$1 49.07,12.09 54.76,6.4 | 54.76,6.4 v54.76,5.69 | 60.45,7.64 59.21,6.4 54.76,6.4 | 60.45,7.64 64.9,12.09 POT4.P$1 65.08,12.09 66.14,11.02 79.83,11.02 80.9,12.09 POT5.P$1 81.08,12.09 82.5,10.67 95.48,10.67 96.9,12.09 POT6.P$1 97.08,12.09 100.81,8.36 114.5,8.36 114.86,8.71 114.86,12.8 | 60.45,7.64 v61.16,6.93 | J11.1 120.55,30.94 120.55,29.87 121.79,28.63 121.79,24.89 120.73,23.82 J10.1 | 113.44,46.23 121.79,37.87 121.79,33.96 119.13,31.29 119.13,27.56 120.55,26.14 120.55,23.82 J10.1
  Bottom 0.152: 31.11,46.23 31.29,46.23 32.18,45.34 R12.1 | 31.11,46.23 30.05,46.23 28.63,44.81 28.63,42.49 R10.1 | v10.13,46.94 10.13,45.34 R4.1 | v17.6,44.63 17.6,42.49 R6.1 | v20.45,44.27 20.45,44.45 21.16,45.16 R8.1 | v31.11,46.41 31.11,46.23 | IC3.6 84.99,38.94 85.52,39.47 85.52,40.36 84.99,40.89 84.99,41.78 IC1.1 84.99,41.96 v85.52,42.49 | v72.72,44.63 72.72,42.49 R26.1 | 61.87,45.16 62.94,46.23 64.36,46.23 65.25,45.34 R24.1 | 61.87,45.16 61.7,44.98 61.7,42.49 R22.1 | 61.87,45.16 54.41,45.16 R20.1 54.23,45.34 v52.81,46.76 | 42.14,46.23 42.32,46.23 43.2,45.34 R16.1 | 42.14,46.23 41.07,46.23 39.65,44.81 39.65,42.49 R14.1 39.65,42.32 39.65,41.25 41.43,39.47 41.43,30.05 51.56,19.91 51.56,14.76 49.07,12.27 POT3.P$1 48.9,12.09 47.83,11.02 47.65,11.02 44.45,7.82 C20.2 | v50.14,43.56 50.49,43.2 50.49,42.49 R18.1 | v42.14,46.94 42.14,46.23 | IC4.11 110.06,35.74 110.59,36.27 110.59,42.32 R52.1 110.77,42.49 v110.77,43.56 | 89.61,6.93 89.61,7.11 90.32,7.82 90.32,9.42 90.68,9.78 93.34,9.78 94.06,9.07 C17.2 | 89.61,6.93 89.61,5.16 C18.2 | 89.61,6.93 88.72,6.93 88.37,7.29 88.37,9.25 89.61,10.49 95.3,10.49 96.9,12.09 POT6.P$1 | 61.16,7.11 60.27,8 C23.2 | 61.16,7.11 61.87,6.4 61.87,4.62 R50.2 62.05,4.45 65.61,4.45 66.67,3.38 71.12,3.38 72.19,4.45 73.61,4.45 C25.2 73.61,4.62 73.61,7.82 C26.2 73.43,8 69.16,8 R48.1 | v54.76,5.69 54.23,5.16 53.7,5.16 IC6.4 | v61.16,6.93 61.16,7.11
GND1  (via drill 0.35)
  Top 0.152: 83.21,40.72 v83.21,41.25 81.97,42.49 75.39,42.49 73.97,41.07 73.97,37.34 75.92,35.38 v76.28,35.38 81.08,30.58 v85.17,30.58 | 83.21,40.72 v83.21,39.65 | v90.68,35.92 89.97,35.92 85.17,40.72 83.21,40.72
  Bottom 0.152: v83.21,39.65 IC3.4 | v83.21,41.25 83.74,41.78 IC1.3 83.74,41.96 83.74,42.49 83.21,43.03 83.21,43.56 83.92,44.27 85.34,44.27 90.14,39.47 90.14,38.76 90.32,38.58 91.92,38.58 92.63,39.29 C1.2 92.81,39.47 93.7,40.36 95.66,40.36 96.55,39.47 R40.1 96.72,39.47 99.21,41.96 99.21,43.92 99.4,44.1 | v76.28,35.38 77.34,34.31 C14.1 | v90.68,35.92 92.99,35.92 R2.1 | v85.17,30.58 85.88,29.87 86.41,29.87 86.94,30.4 86.94,30.76 IC2.5 | 99.4,44.1 100.17,45.87 103.97,45.87 SW1.P$2 | J7.GND 98.83,44.1 99.4,44.1
N$1
  Bottom 0.152: C8.1 17.42,34.14 17.42,17.78 19.2,16 19.2,15.11 17.6,13.51 14.4,13.51 13.16,12.27 POT1.P$3
N$2
  Bottom 0.152: 115.71,48.4 115.51,48.2 | 115.51,48.2 111.68,48.2 110.05,49.83 109.17,49.83 SW1.P$3 | J8.2 120.37,37.52 120.37,43.38 115.57,48.18 115.51,48.2
N$3
  Bottom 0.152: R6.2 16,42.32 16,41.25 17.42,39.83 R5.1 17.42,39.65 17.42,36.27 15.47,34.31 C8.2 15.47,34.14 15.47,20.45 R28.1
N$5
  Top 0.152: J1.3 16.71,46.58 14.94,46.58 9.42,41.07 7.82,41.07 4.45,37.69 4.45,16.71 8.89,12.27 POT1.P$5
N$7  (via drill 0.35)
  Top 0.152: v117.53,26.67 v114.86,29.34
  Bottom 0.152: C15.1 108.1,9.07 111.12,9.07 R42.2 111.3,9.07 112.01,9.78 113.08,9.78 115.04,11.73 115.04,12.8 117.53,15.29 v117.53,26.67 | v114.86,29.34 113.97,30.23 IC4.1
N$8
  Bottom 0.152: C2.1 11.38,34.14 11.38,39.29 11.02,39.65 11.02,41.43 12.09,42.49 14.58,42.49 15.29,43.2 16.54,43.2 16.71,43.03 16.71,41.6 17.6,40.72 18.14,40.72 18.49,40.36 18.49,28.45 17.96,27.91 17.96,17.78 19.56,16.18 19.56,14.94 17.78,13.16 16,13.16 15.11,12.27 POT1.P$2
N$9
  Top 0.152: J1.2 9.25,39.29 9.6,39.29 13.69,35.2 J1.4 13.69,35.03 13.69,30.76 6.76,23.82 6.76,15.11 7.47,14.4 8.71,14.4 10.85,12.27 POT1.P$4
N$13
  Bottom 0.152: R4.2 8.71,45.16 8.71,42.85 R3.1 8.71,42.67 8.71,34.67 9.25,34.14 C2.2 9.42,33.96 9.42,20.45 R27.1
N$15
  Bottom 0.152: 115.57,33.6 113.97,33.6 112.55,35.03 112.55,35.56 IC4.13 | 115.57,33.6 116.46,33.6 R46.2 | 115.57,33.6 115.57,28.98 115.21,28.63 115.04,28.63 113.44,27.03 113.08,27.03 POT14.2.3
N$16
  Top 0.152: J9.2 75.92,39.12 76.45,39.12 80.37,35.2 J9.4 80.54,35.03 86.23,35.03 103.83,17.42 107.21,17.42 111.84,12.8 POT13.P$2
N$17  (via drill 0.35)
  Top 0.152: v103.12,27.56 103.83,27.56 104.9,28.63 v105.61,28.63
  Bottom 0.152: R43.2 111.12,6.04 108.81,6.04 C16.1 108.64,5.87 108.28,5.87 107.39,4.98 105.97,4.98 103.12,7.82 v103.12,27.56 | v105.61,28.63 105.61,29.69 106.15,30.23 IC4.7
N$18
  Top 0.152: J9.3 83.57,46.58 81.61,46.58 77.88,42.85 75.21,42.85 73.61,41.25 73.61,36.98 82.32,28.27 90.86,28.27 105.26,13.87 108.81,13.87 109.88,12.8 POT13.P$3
N$19
  Bottom 0.152: R28.2 13.87,20.27 13.87,15.65 POT7.2.2
N$21  (via drill 0.35)
  Top 0.152: v118.59,34.67 118.59,21.87 117.53,20.8 117.53,17.25 118.59,16.18 J10.3
  Bottom 0.152: v118.59,34.67 118.59,39.47 116.81,41.25 116.81,42.32 C22.2
N$22
  Bottom 0.152: R10.2 27.03,42.32 28.45,40.89 28.45,39.83 R9.1 28.45,39.65 28.45,36.27 26.49,34.31 C9.2 26.49,34.14 26.49,29.69 31.29,24.89 31.29,20.45 R30.1
N$23  (via drill 0.35)
  Top 0.152: v101.35,40.54 101.35,28.27 107.04,22.58 | 107.04,22.58 107.04,19.2 J10.4 | 107.04,22.58 108.1,23.65 111.3,23.65 J10.2
  Bottom 0.152: v101.35,40.54 102.59,41.78 102.59,42.49 C21.2
N$24
  Bottom 0.152: C21.1 104.72,42.49 104.72,39.83 106.15,38.41 106.15,35.74 IC4.8 106.15,35.56 104.9,34.31 104.9,27.03 POT14.1.2
N$25  (via drill 0.35)
  Top 0.152: v114.86,34.67 111.12,30.94 111.12,27.03 POT14.2.2
  Bottom 0.152: C22.1 114.68,42.32 114.68,36.45 113.97,35.74 IC4.14 113.97,35.56 v114.86,34.67
N$26
  Top 0.152: J2.3 27.74,46.58 25.96,46.58 20.45,41.07 18.67,41.07 17.96,40.36 17.96,18.85 24.54,12.27 24.89,12.27 POT2.P$5
N$27
  Bottom 0.152: R29.2 23.82,20.27 23.82,15.65 POT8.1.2
N$28  (via drill 0.35)
  Top 0.152: v28.27,28.98 28.27,25.07 22.76,19.56 22.76,15.11 23.82,14.05 27.2,14.05 28.98,12.27 POT2.P$3
  Bottom 0.152: v28.27,28.98 28.27,34.14 C9.1
N$29  (via drill 0.35)
  Top 0.152: v28.8,24.54 28.8,22.4 35.2,16 35.2,15.11 33.25,13.16 32,13.16 31.11,12.27 POT2.P$2
  Bottom 0.152: v28.8,24.54 22.58,30.76 22.58,33.96 C3.1
N$30
  Top 0.152: J2.2 20.27,39.29 20.62,39.29 24.71,35.2 J2.4 24.71,35.03 24.71,25.78 22.4,23.47 22.4,14.94 23.65,13.69 25.43,13.69 26.85,12.27 POT2.P$4
N$31
  Bottom 0.152: R8.2 19.74,45.16 19.74,42.85 R7.1 19.74,42.67 19.74,34.67 20.27,34.14 C3.2 20.45,33.96 20.45,32.36 25.25,27.56 25.25,20.45 R29.1
N$32
  Bottom 0.152: R30.2 29.87,20.27 29.87,15.65 POT8.2.2
N$41
  Bottom 0.152: R14.2 39.47,40.72 39.47,39.83 R13.1 39.47,39.65 39.47,36.27 37.52,34.31 C10.2 37.52,34.14 37.52,32.89 47.83,22.58 47.83,21.16 47.47,20.8 47.47,20.45 R32.1
N$42
  Top 0.152: J3.3 38.76,46.58 36.8,46.58 31.29,41.07 29.69,41.07 29.52,40.89 29.52,22.4 39.65,12.27 40.89,12.27 POT3.P$5
N$43
  Bottom 0.152: R31.2 39.83,20.27 39.83,15.65 POT9.1.2
N$44
  Bottom 0.152: C10.1 39.47,34.14 39.47,31.47 51.21,19.74 51.21,15.11 49.25,13.16 46.05,13.16 45.16,12.27 POT3.P$3
N$45  (via drill 0.35)
  Top 0.152: v33.43,21.16 v33.43,26.67
  Bottom 0.152: v33.43,26.67 33.43,33.96 C4.1 | v33.43,21.16 38.76,15.82 38.76,12.45 40.18,11.02 45.87,11.02 46.94,12.09 POT3.P$2
N$46
  Top 0.152: J3.2 31.29,39.29 31.65,39.29 35.74,35.2 J3.4 35.92,35.03 40.01,30.94 40.01,26.49 47.47,19.02 48.18,19.02 51.21,16 51.21,15.11 50.49,14.4 45.16,14.4 43.03,12.27 POT3.P$4
N$47
  Bottom 0.152: R12.2 30.76,45.16 30.76,42.85 R11.1 30.76,42.67 30.76,34.67 31.29,34.14 C4.2 31.47,33.96 31.47,27.56 34.31,24.71 36.98,24.71 41.25,20.45 R31.1
N$48
  Bottom 0.152: R32.2 45.87,20.27 45.87,15.65 POT9.2.2
N$55
  Bottom 0.152: R27.2 7.82,20.27 7.82,15.65 POT7.1.2
N$58
  Bottom 0.152: R18.2 48.9,42.32 48.9,41.43 50.49,39.83 R17.1 50.49,39.65 50.49,36.45 48.36,34.31 C11.2 48.36,34.14 52.09,30.4 54.76,30.4 63.3,21.87 63.3,20.45 R34.1
N$59
  Top 0.152: J4.3 49.78,46.58 47.83,46.58 42.32,41.07 40.72,41.07 40.54,40.89 40.54,26.49 47.65,19.38 49.43,19.38 56.54,12.27 56.9,12.27 POT4.P$5
N$60
  Bottom 0.152: R33.2 55.83,20.27 55.83,15.65 POT10.1.2
N$61
  Bottom 0.152: R45.1 102.06,33.6 102.06,29.69 103.83,27.91 103.83,14.94 105.97,12.8 POT13.P$5 105.97,12.62 105.97,9.07 C15.2
N$62  (via drill 0.35)
  Top 0.152: v53.52,31.11 53.52,30.4 59.74,24.18 59.74,22.23 65.25,16.71 66.5,16.71 67.21,16 67.21,15.11 65.25,13.16 62.05,13.16 61.16,12.27 POT4.P$3
  Bottom 0.152: v53.52,31.11 50.49,34.14 C11.1
N$63
  Bottom 0.152: C5.1 44.45,34.14 44.45,36.09 48.01,39.65 48.01,43.03 49.25,44.27 50.49,44.27 51.74,43.03 51.74,39.47 61.16,30.05 61.16,25.78 67.21,19.74 67.21,15.11 65.25,13.16 64.01,13.16 63.12,12.27 POT4.P$2
N$64
  Top 0.152: 46.58,35.03 42.32,39.29 J4.2 | POT4.P$4 57.07,14.05 55.3,14.05 48.54,20.8 46.76,20.8 45.87,21.69 45.87,34.31 46.58,35.03 | 46.58,35.03 J4.4
N$65
  Bottom 0.152: R16.2 41.6,45.16 41.6,42.85 R15.1 41.78,42.67 41.78,34.67 42.32,34.14 C5.2 42.49,33.96 42.49,32.54 50.32,24.71 52.98,24.71 57.25,20.45 R33.1
N$66
  Bottom 0.152: R34.2 61.87,20.27 61.87,15.65 POT10.2.2
N$75  (via drill 0.35)
  Top 0.152: v59.92,43.56 59.92,38.94 v60.27,38.58
  Bottom 0.152: 61.7,35.38 60.45,35.38 59.38,34.31 C12.2 | 61.7,35.38 61.87,35.38 62.23,35.03 62.23,28.8 66.32,24.71 68.81,24.71 72.54,20.98 72.54,19.74 72.9,19.38 73.97,19.38 75.92,21.34 78.41,21.34 79.3,20.45 R36.1 | 61.7,35.38 61.7,38.58 | 61.7,38.58 61.7,39.65 R21.1 | v59.92,43.56 59.92,42.49 R22.2 | 61.7,38.58 v60.27,38.58
N$76
  Top 0.152: J5.3 60.98,46.58 60.98,22.05 63.65,19.38 65.79,19.38 72.9,12.27 POT5.P$5
N$77
  Bottom 0.152: R35.2 71.83,20.27 71.83,15.65 POT11.1.2
N$78
  Bottom 0.152: C12.1 61.52,34.14 61.52,25.96 70.76,16.71 70.76,15.11 72.36,13.51 75.74,13.51 76.99,12.27 POT5.P$3
N$79  (via drill 0.35)
  Top 0.152: v65.79,20.09 72.72,13.16 78.05,13.16 78.94,12.27 POT5.P$2
  Bottom 0.152: v65.79,20.09 55.47,30.4 55.47,33.96 C6.1
N$80  (via drill 0.35)
  Top 0.152: J5.2 53.16,39.29 53.52,39.29 57.61,35.2 J5.4 57.78,35.03 60.1,32.72 60.1,22.4 63.48,19.02 64.72,19.02 v70.59,13.16
  Bottom 0.152: v70.59,13.16 73.97,13.16 74.85,12.27 POT5.P$4
N$81  (via drill 0.35)
  Top 0.152: v53.34,36.09 51.56,37.87 51.56,40.89 52.27,41.6 v52.45,41.6
  Bottom 0.152: 53.52,43.74 56.72,43.74 59.03,41.43 62.76,41.43 68.81,35.38 68.81,32.54 73.25,28.09 73.25,20.45 R35.1 | 53.52,43.74 52.63,42.85 R19.1 52.45,42.67 v52.45,41.6 | 53.52,43.74 52.63,44.63 52.63,45.16 R20.2 | v53.34,36.09 53.34,34.14 C6.2
N$82
  Bottom 0.152: R36.2 77.88,20.27 77.88,15.65 POT11.2.2
N$91  (via drill 0.35)
  Top 0.152: v71.65,37.52 v71.65,35.56
  Bottom 0.152: R26.2 70.94,42.32 70.94,41.43 72.54,39.83 R25.1 | R38.1 95.3,20.45 88.01,27.74 88.01,27.91 86.77,29.16 84.28,29.16 73.79,39.65 72.72,39.65 R25.1 | v71.65,35.56 70.41,34.31 C13.2 | v71.65,37.52 71.65,38.76 72.54,39.65 R25.1
N$92
  Top 0.152: J6.3 72.01,46.58 72.01,38.23 73.25,36.98 73.25,27.74 84.99,16 84.99,14.58 87.3,12.27 88.9,12.27 POT6.P$5
N$93
  Bottom 0.152: R37.2 87.83,20.27 87.83,15.65 POT12.1.2
N$94
  Bottom 0.152: C13.1 72.36,34.14 72.36,29.52 88.37,13.51 91.75,13.51 92.99,12.27 POT6.P$3
N$95  (via drill 0.35)
  Top 0.152: v68.1,32.36 84.63,15.82 84.63,14.4 88.01,11.02 93.88,11.02 94.94,12.09 POT6.P$2
  Bottom 0.152: v68.1,32.36 66.5,33.96 C7.1
N$96  (via drill 0.35)
  Top 0.152: 67.39,35.2 68.63,35.2 J6.4 67.39,35.2 | 67.39,35.2 66.85,35.2 64.19,37.87 64.19,39.29 J6.2 | v84.81,13.16 84.81,13.69 83.21,15.29 83.21,16.71 68.28,31.65 67.74,31.65 67.39,32 67.39,35.2
  Bottom 0.152: v84.81,13.16 89.97,13.16 90.86,12.27 POT6.P$4
N$97  (via drill 0.35)
  Top 0.152: v67.92,37.69 v66.67,36.45
  Bottom 0.152: R24.2 63.65,45.16 63.65,42.85 R23.1 63.65,42.67 63.65,42.14 67.92,37.87 | 67.92,37.87 68.99,36.8 71.48,36.8 73.25,35.03 73.25,33.78 82.32,24.71 84.99,24.71 89.26,20.45 R37.1 | v66.67,36.45 66.67,36.27 64.54,34.14 C7.2 | 67.92,37.87 v67.92,37.69
N$98
  Bottom 0.152: R38.2 93.88,20.27 93.88,15.65 POT12.2.2
N$114  (via drill 0.35)
  Top 0.152: LED1.A 113.32,49.32 v109.5,45.5
  Bottom 0.152: R1.1 100.46,39.47 100.46,40.72 101.88,42.14 101.88,43.38 103.48,44.98 108.98,44.98 v109.5,45.5
N$115
  Bottom 0.152: D1.A 100.46,4.45 99.92,3.91 95.66,3.91 94.59,2.85 93.34,2.85 IC5.1 93.17,2.85 89.43,2.85 88.37,3.91 82.32,3.91 79.48,6.76 L1.P$2
N$116
  Bottom 0.152: 91.21,5.33 91.21,5.16 C18.1 91.21,5.33 | 91.21,5.33 91.21,8.71 R44.1 | 91.21,5.33 93.88,5.33 94.41,4.8 95.83,4.8 IC5.4
N$117
  Bottom 0.152: 67.03,8.18 67.21,8 R48.2 | 67.03,8.18 65.79,9.42 50.32,9.42 46.58,5.69 46.58,4.98 46.05,4.45 46.05,2.13 R47.1 | C19.2 67.39,4.45 67.39,7.82 R48.2 | 67.03,8.18 68.45,9.6 85.34,9.6 87.66,7.29 87.66,5.51 88.9,4.27 91.92,4.27 92.28,4.62 93.17,4.62 IC5.3 | 67.03,8.18 R48.2
N$118
  Bottom 0.152: R50.1 60.1,4.45 57.96,4.45 C24.2 57.78,4.62 56.01,6.4 55.83,6.4 | 55.83,6.4 53.7,6.4 IC6.2 | 55.83,6.4 57.61,8.18 R49.2
N$119  (via drill 0.35)
  Top 0.152: v52.09,4.62 71.65,4.62 v72.54,3.73
  Bottom 0.152: v52.09,4.62 51.03,5.69 49.25,5.69 IC6.6 | v72.54,3.73 74.68,3.73 75.39,4.45 C25.1
N$121
  Bottom 0.152: R39.1 98.32,43.38 90.86,43.38 87.66,46.58 LED2.K
N$122
  Bottom 0.152: R39.2 99.92,43.2 99.92,42.14 97.43,39.65 97.43,38.76 96.37,37.69 92.99,37.69 92.63,37.34 90.5,37.34 88.01,34.85 88.01,33.6 IC2.3
N$123
  Bottom 0.152: R40.2 94.77,39.29 94.06,39.29 92.46,37.69 89.79,37.69 86.23,34.14 86.23,33.6 IC2.1
N$124
  Bottom 0.152: R2.2 94.77,35.74 89.97,30.94 88.01,30.94 IC2.4
N$125  (via drill 0.35)
  Top 0.152: v94.06,33.07 92.28,33.07 85.34,40.01 v84.81,40.01 83.21,38.41 78.94,38.41 77.7,39.65 77.7,40.54 77.17,41.07 74.5,41.07 74.32,40.89 74.32,37.69 75.21,36.8 v75.56,36.8
  Bottom 0.152: v84.81,40.01 84.45,39.65 84.45,38.94 IC3.5 | v94.06,33.07 94.06,32.18 94.23,32 R41.2 | v75.56,36.8 75.56,34.31 C14.2
N$126
  Bottom 0.152: IC1.4 83.74,43.2 83.74,43.03 84.1,42.67 84.63,42.67 84.81,42.85 84.81,43.2 IC1.6
N$127
  Bottom 0.152: IC1.5 84.28,43.38 84.28,43.56 84.63,43.92 85.17,43.92 86.23,42.85 86.23,38.23 85.17,37.16 84.63,37.16 84.45,37.34 84.45,37.69 IC3.2
N$128
  Bottom 0.152: IC1.2 84.28,41.78 84.28,41.25 83.39,40.36 82.86,40.36 82.5,40.01 82.5,39.29 83.92,37.87 IC3.3
OUT-L  (via drill 0.35)
  Top 0.152: v46.58,22.4 51.21,22.4 57.96,15.65 POT10.1.1 | v30.23,22.76 30.76,22.76 34.67,18.85 38.76,18.85 41.96,15.65 POT9.1.1 | v114.15,9.07 102.06,9.07 97.08,14.05 91.57,14.05 90.14,15.47 POT12.1.1 89.97,15.47 88.54,14.05 v86.77,14.05 | v113.79,28.45 115.21,28.45 116.81,26.85 v116.81,13.51
  Bottom 0.152: POT7.1.1 9.96,15.47 9.96,15.11 7.82,12.98 7.82,11.38 8.18,11.02 20.8,11.02 24.18,14.4 24.71,14.4 25.96,15.65 POT8.1.1 26.14,15.65 26.14,18.67 v30.23,22.76 | v46.58,22.4 45.7,22.4 42.14,18.85 42.14,15.65 POT9.1.1 | R42.1 113.08,9.07 v114.15,9.07 116.81,11.73 v116.81,13.51 | v113.79,28.45 112.55,29.69 112.55,30.23 IC4.2 | v86.77,14.05 82.14,14.05 | 82.14,14.05 75.56,14.05 74.14,15.47 POT11.1.1 | 82.14,14.05 82.14,11.2 81.97,11.02 56.19,11.02 55.83,11.38 55.83,12.98 57.96,15.11 57.96,15.47 POT10.1.1
OUT-L1
  Bottom 0.152: 105.79,43.2 105.44,43.56 104.01,43.56 103.83,43.38 103.83,41.96 101.35,39.47 101.35,38.94 100.46,38.05 100.46,33.78 R45.2 | 105.79,43.2 105.79,39.29 107.39,37.69 107.39,35.74 IC4.9 | 105.79,43.2 106.86,44.27 114.68,44.27 115.57,43.38 115.57,41.43 115.04,40.89 115.04,36.45 115.21,36.27 115.39,36.27 117.35,34.31 117.35,30.23 115.04,27.91 115.04,27.03 POT14.1.3
OUT-R  (via drill 0.35)
  Top 0.152: v23.29,12.45 22.58,13.16 14.76,13.16 12.45,15.47 12.09,15.47 POT7.2.1 | v34.85,18.14 38.58,14.4 42.49,14.4 43.56,15.47 43.92,15.47 POT9.2.1 | v62.59,21.51 70.05,21.51 75.92,15.65 POT11.2.1 | v101.7,10.49 101.17,10.49 97.26,14.4 93.17,14.4 92.1,15.47 POT12.2.1 91.92,15.65 90.86,16.71 87.48,16.71 v85.7,14.94 | v106.68,28.63 105.97,29.34 103.48,29.34 v102.41,28.27 | v47.12,21.51 48.36,21.51 55.47,14.4 58.85,14.4 59.92,15.47 POT10.2.1
  Bottom 0.152: v23.29,12.45 25.25,14.4 26.85,14.4 27.91,15.47 POT8.2.1 28.09,15.47 29.16,14.4 34.49,14.4 35.2,15.11 35.2,16 34.85,16.36 v34.85,18.14 | v62.59,21.51 61.34,21.51 60.1,20.27 60.1,15.65 POT10.2.1 | R43.1 112.72,6.04 111.3,4.62 105.79,4.62 101.7,8.71 v101.7,10.49 102.41,11.2 v102.41,28.27 | v106.68,28.63 107.39,29.34 107.39,30.23 IC4.6 | v85.7,14.94 85.17,14.4 77.52,14.4 76.45,15.47 76.1,15.47 POT11.2.1 | v47.12,21.51 45.34,21.51 44.09,20.27 44.09,15.65 POT9.2.1
OUT-R1
  Bottom 0.152: R46.1 118.06,33.43 118.06,28.27 108.1,18.31 108.1,12.8 POT13.P$4 107.92,12.62 106.86,11.56 106.86,6.04 C16.2
V+  (via drill 0.35)
  Top 0.152: v93.34,36.98 93.34,43.56 87.66,49.25 LED2.A | v45.87,5.33 v47.3,5.33 54.05,5.33 54.41,4.98 72.72,4.98 v76.45,8.71 v99.03,8.71 | v99.92,20.27 v88.01,32.18
  Bottom 0.152: C1.1 90.86,39.47 90.86,41.96 86.41,46.41 86.41,48.18 87.48,49.25 LED2.A 90.45,46.37 J7.VBUS | 88.01,32.54 88.37,32.54 89.97,34.14 89.97,36.27 90.68,36.98 v93.34,36.98 | 88.01,32.54 87.3,32.54 86.23,31.47 86.23,30.94 IC2.6 | 48.36,5.33 48.54,5.16 49.07,5.16 IC6.5 | 48.36,5.33 48.36,6.76 48.54,6.93 49.07,6.93 IC6.8 | R47.2 44.45,2.13 44.45,4.8 C20.1 44.45,4.98 44.81,5.33 v45.87,5.33 | v47.3,5.33 48.36,5.33 | C19.1 68.99,4.45 68.99,6.4 68.28,7.11 68.28,8.71 68.45,8.89 74.32,8.89 75.21,8 C26.1 75.39,8 76.1,8.71 v76.45,8.71 | v99.03,8.71 99.92,8.71 | 99.92,8.71 100.46,8.71 D1.C 99.92,8.71 | v88.01,32.18 88.01,32.54 | 99.92,8.71 v99.92,20.27
VBAT  (via drill 0.35)
  Top 0.152: v86.94,6.93 88.37,6.93 v89.08,7.64
  Bottom 0.152: 101,3.56 101.35,3.56 101.7,3.91 101.7,5.16 98.86,8 98.32,8 | 101,3.56 97.26,3.56 96.55,2.85 96.01,2.85 IC5.5 | 98.32,8 96.9,8 96.01,8.89 C17.1 95.83,9.07 94.77,10.13 90.5,10.13 89.61,9.25 89.61,8.89 R44.2 89.43,8.71 89.08,8.36 v89.08,7.64 | v86.94,6.93 83.92,6.93 L1.P$1 | R1.2 98.5,39.29 98.5,38.05 95.3,34.85 94.77,34.85 92.81,32.89 92.81,32 R41.1 92.63,31.83 90.32,29.52 | 90.32,29.52 85.17,29.52 84.45,30.23 84.45,30.94 84.81,31.29 85.17,31.29 86.94,33.07 86.94,33.43 IC2.2 | 98.32,8 98.32,14.22 99.21,15.11 99.21,20.62 90.32,29.52 | J8.1 120.5,32.5 120,32.5 119,31.5 119,22 120.5,22 121.5,21 121.5,6 114.5,6 112.5,4 102,4 101.5,3.5 101,3.5 101,3.56
VGND
  Bottom 0.152: R52.2 112.37,42.32 112.37,37.34 111.3,36.27 111.3,35.74 IC4.12 111.3,35.56 111.3,30.4 IC4.3 111.12,30.23 111.12,29.69 110.41,28.98 109.53,28.98 108.81,29.69 108.81,30.23 IC4.5 108.81,30.4 108.81,35.56 IC4.10 108.64,35.74 108.64,42.32 R51.1

### Text on the board
tNames: Analog-Mixer-OPA4134-K / 2018 Ali Momeni @ Pittsburgh